# EAGLE design board (EAGLE 9.6.2)
CDESIGNER: Kihun Song; CNAME: nRF52-BLEUart-module; CREVISION: V1.1.0

## Sheet 1 of 2
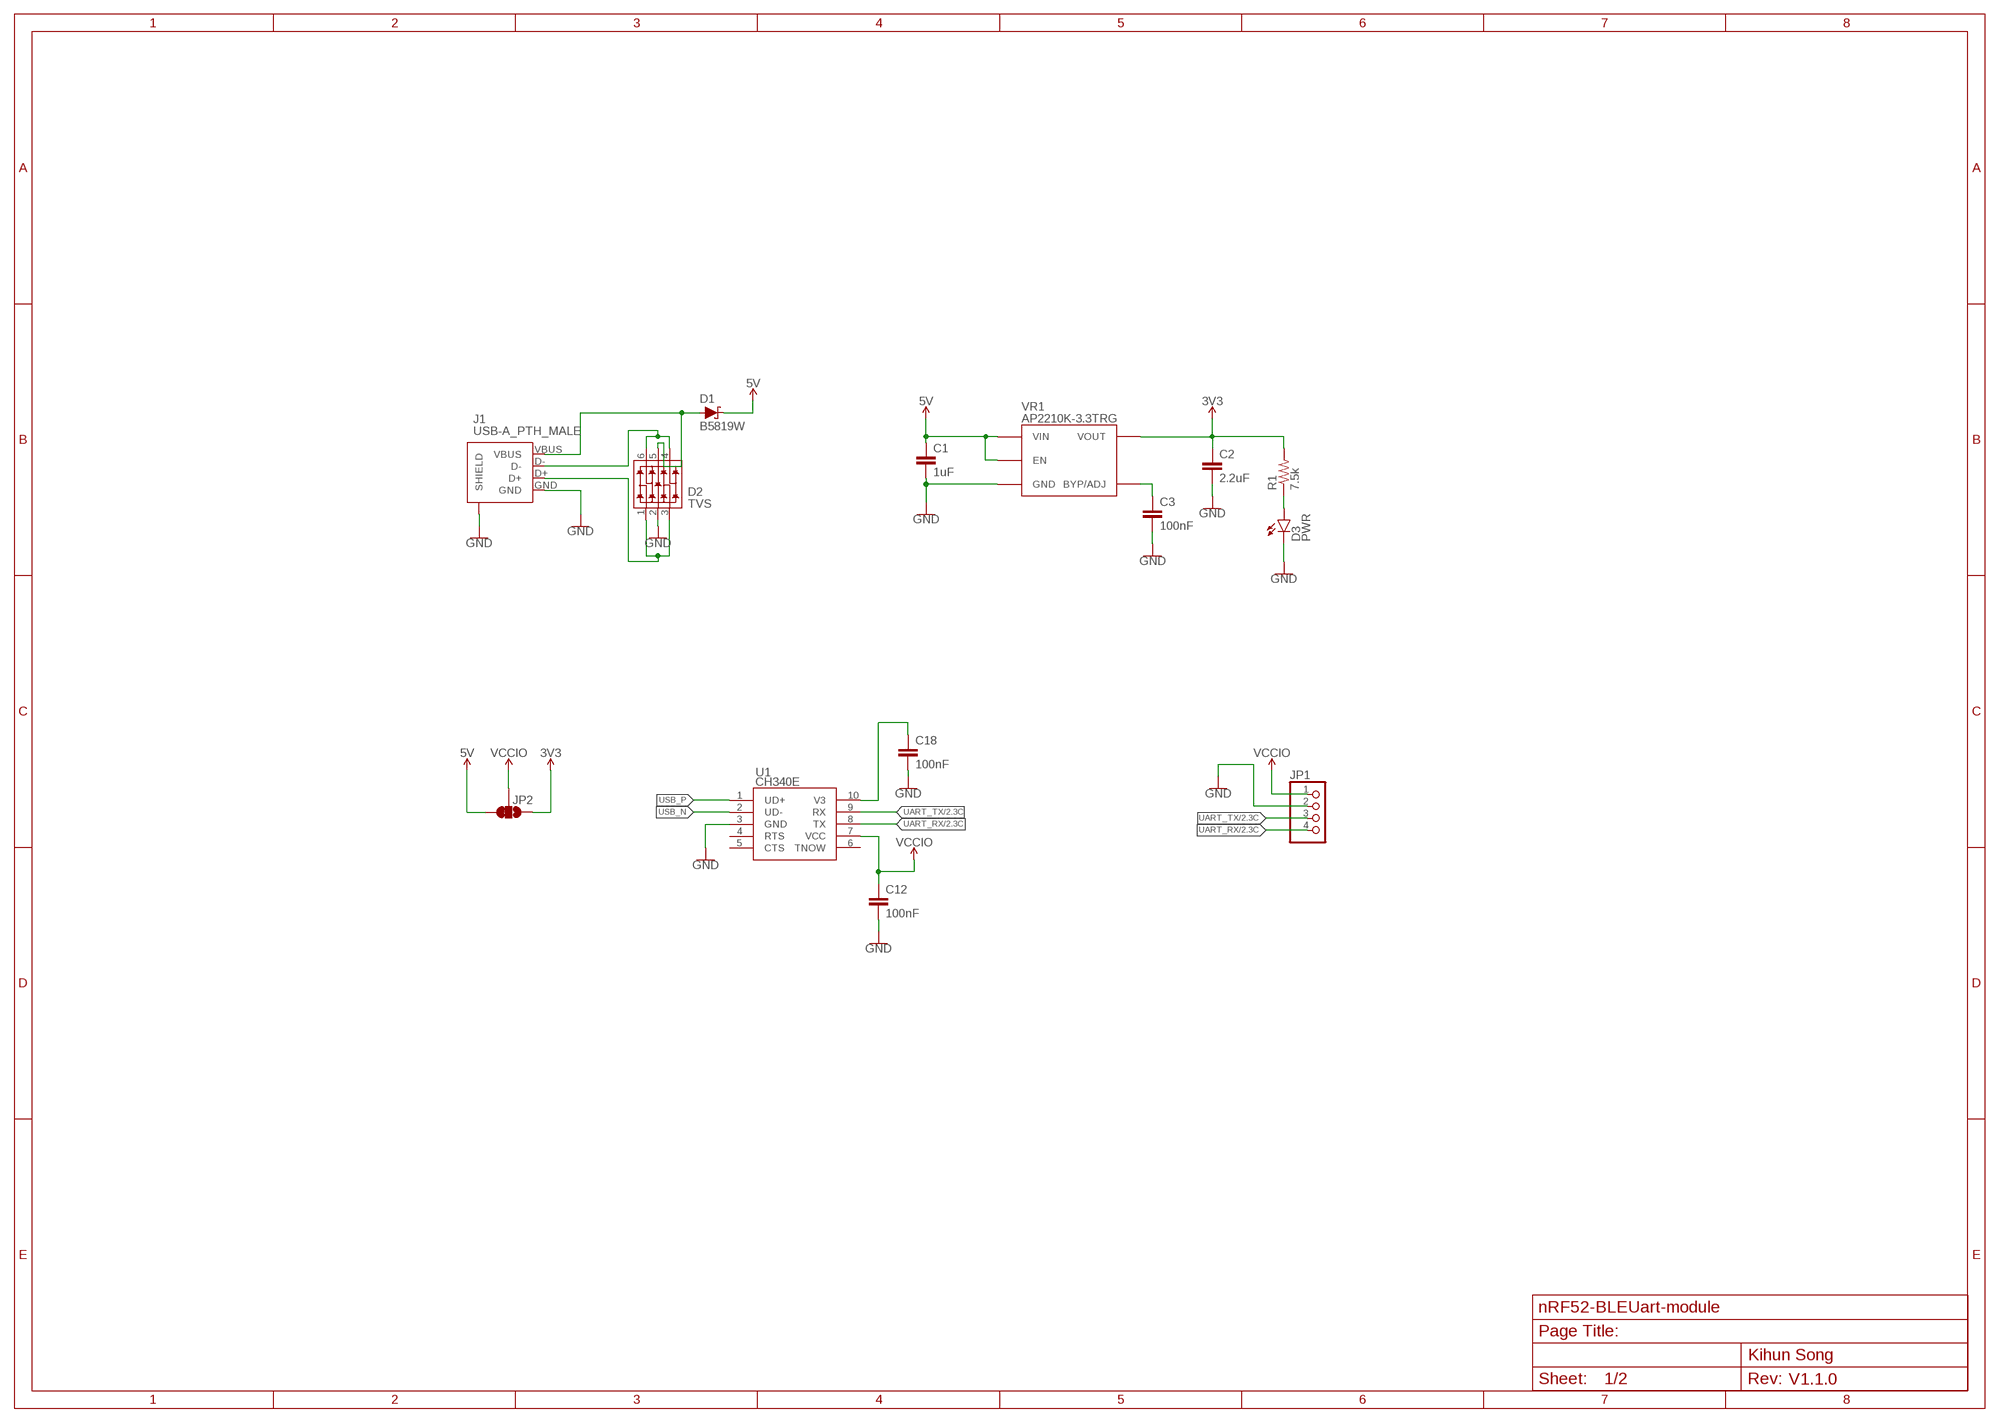
[diagram p0: schematic, sheet 1]

### Parts
C1  1uF  C-NON-POLC0402  [C0402]
C2  2.2uF  C-NON-POLC0603  [C0603]
C3  100nF  C-NON-POLC0402  [C0402]
C12  100nF  C-NON-POLC0402  [C0402]
C18  100nF  C-NON-POLC0402  [C0402]
D1  B5819W  DIODE-SCHOTTKY_SOD-123  [SOD-123]
D2  TVS  TVS-ARRAY_SOT-23-6  [SPT-23-6]
D3  PWR  LED_0603  [LED_0603]
J1  USB-A_PTH_MALE  USB-A_PTH_MALE-U-G-O4DD-W-1  [USB-A-MALE-H-PTH-1]
JP1  Rx Tx G V  PINHD-1X4NOSILK  [1X04-NOSILK]
JP2  5V 3V3  JUMPER-SMT_3_1-NC_TRACE_NO-SILK  [SMT-JUMPER_3_1-NC_TRACE_NO-SILK]
R1  7.5k  RR0402  [R0402]
U1  CH340E  [MSOP-10]
VR1  AP2210K-3.3TRG  AP2210K  [SOT-23-5]

### Nets
3V3 [power]: C2.1 JP2.1 R1.2 VR1.5(VOUT) ; also sheet 2
5V: C1.1 D1.C JP2.3 VR1.1(VIN) VR1.3(EN)
GND [power]: C1.2 C2.2 C3.2 C12.2 C18.2 D2.2(VSS) D3.C J1.GND J1.SHIELD@0(SHIELD) J1.SHIELD@1(SHIELD) J1.SHIELD@2(SHIELD) J1.SHIELD@3(SHIELD) JP1.2 U1.3(GND) VR1.2(GND) ; also sheet 2
N$3 [power]: C3.1 VR1.4(BYP/ADJ)
N$6: D3.A R1.1
N$16 [power]: C18.1 U1.10(V3)
UART_RX: JP1.4 U1.8(TX) ; also sheet 2
UART_TX: JP1.3 U1.9(RX) ; also sheet 2
USB_IN [power]: D1.A D2.5(VCC) J1.VBUS
USB_N: D2.4(IO3) D2.6(IO4) J1.D- U1.2(UD-)
USB_P: D2.1(IO1) D2.3(IO2) J1.D+ U1.1(UD+)
VCCIO [power]: C12.1 JP1.1 JP2.2 U1.7(VCC)
Unconnected: U1.4(RTS) U1.5(CTS) U1.6(TNOW)

## Sheet 2 of 2
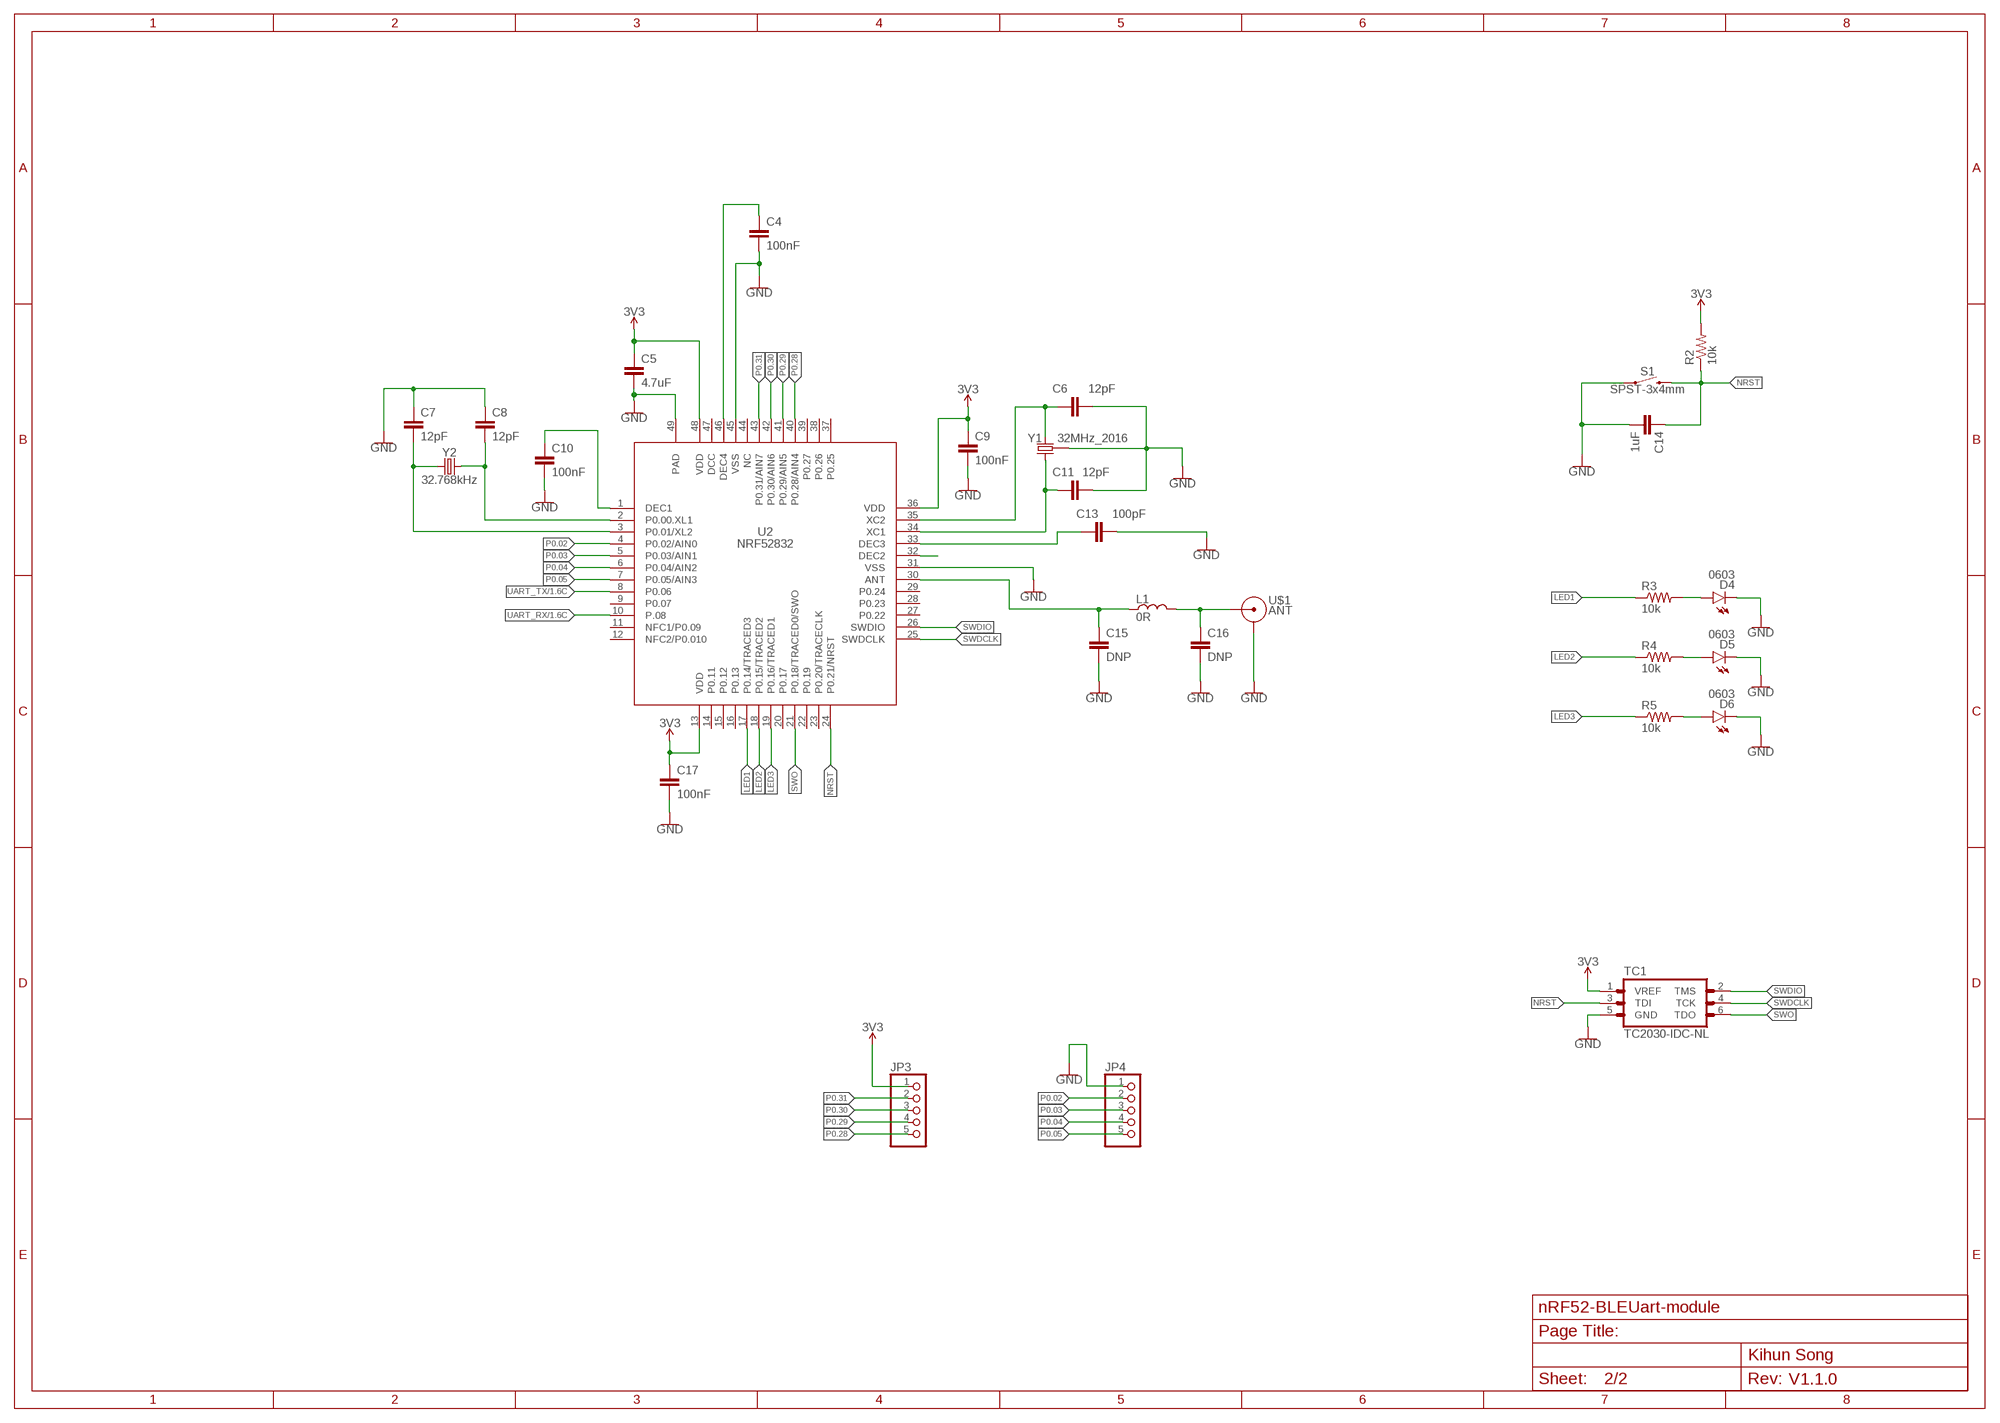
[diagram p1: schematic, sheet 2]

### Parts
C4  100nF  C-NON-POLC0402  [C0402]
C5  4.7uF  C-NON-POLC0402  [C0402]
C6  12pF  C-NON-POLC0402  [C0402]
C7  12pF  C-NON-POLC0402  [C0402]
C8  12pF  C-NON-POLC0402  [C0402]
C9  100nF  C-NON-POLC0402  [C0402]
C10  100nF  C-NON-POLC0402  [C0402]
C11  12pF  C-NON-POLC0402  [C0402]
C13  100pF  C-NON-POLC0402  [C0402]
C14  1uF  C-NON-POLC0402  [C0402]
C15  DNP  C-NON-POLC0402  [C0402]
C16  DNP  C-NON-POLC0402  [C0402]
C17  100nF  C-NON-POLC0402  [C0402]
D4  0603  LED_0603  [LED_0603]
D5  0603  LED_0603  [LED_0603]
D6  0603  LED_0603  [LED_0603]
JP3  PINHD-1X5-NOSILK  [1X05-NOSILK]
JP4  PINHD-1X5-NOSILK  [1X05-NOSILK]
L1  0R  L0402  [R0402]
R2  10k  RR0402  [R0402]
R3  10k  RR0402  [R0402]
R4  10k  RR0402  [R0402]
R5  10k  RR0402  [R0402]
S1  SPST-3x4mm  SWITCH-SPST-SMD-3.0X4.0MM  [TACTILE_SWITCH_SMD_3.0X4.0MM]
TC1  TC2030-IDC-NL  [TC2030-IDC-NL]
U2  NRF52832  [QFN40P600X600X90-49T450N]
U$1  ANT  INVERTED_F_2.4GHZ_TI-AN043_L_SHORT  [TI-AN043_LEFT_SHORTER]
Y1  32MHz_2016  CRYSTAL-2.0X1.6MM  [CRYSTAL-SMD-2.0X1.6MM]
Y2  32.768kHz  CRYSTAL-32.768KHZ_3215  [CRYSTAL-SMD-3.2X1.5MM]

### Nets
3V3 [power]: C5.1 C9.1 C17.1 JP3.1 R2.2 TC1.1(VREF) U2.13(VDD) U2.36(VDD) U2.48(VDD) ; also sheet 1
GND [power]: C4.2 C5.2 C6.2 C7.1 C8.1 C9.2 C10.2 C11.2 C13.2 C14.2 C15.2 C16.2 C17.2 D4.C D5.C D6.C JP4.1 S1.1 TC1.5(GND) U2.31(VSS) U2.45(VSS) U2.49(PAD) U$1.GND Y1.2(GND) Y1.4(GND) ; also sheet 1
LED1: R3.1 U2.17(P0.14/TRACED3)
LED2: R4.1 U2.18(P0.15/TRACED2)
LED3: R5.1 U2.19(P0.16/TRACED1)
N$1: C8.2 U2.2(P0.00.XL1) Y2.P$2
N$2: D4.A R3.2
N$4: C7.2 U2.3(P0.01/XL2) Y2.P$1
N$5 [power]: C10.1 U2.1(DEC1)
N$7 [power]: C4.1 U2.46(DEC4)
N$8: C6.1 U2.35(XC2) Y1.3
N$9: C11.1 U2.34(XC1) Y1.1
N$10 [power]: C13.1 U2.33(DEC3)
N$11: U2.32(DEC2)
N$12: D5.A R4.2
N$14: D6.A R5.2
NRST: C14.1 R2.1 S1.2 TC1.3(TDI) U2.24(P0.21/NRST)
P0.02: JP4.2 U2.4(P0.02/AIN0)
P0.03: JP4.3 U2.5(P0.03/AIN1)
P0.04: JP4.4 U2.6(P0.04/AIN2)
P0.05: JP4.5 U2.7(P0.05/AIN3)
P0.28: JP3.5 U2.40(P0.28/AIN4)
P0.29: JP3.4 U2.41(P0.29/AIN5)
P0.30: JP3.3 U2.42(P0.30/AIN6)
P0.31: JP3.2 U2.43(P0.31/AIN7)
RF-1 [RF]: C15.1 L1.1 U2.30(ANT)
RF-2 [RF]: C16.1 L1.2 U$1.RF(FEED)
SWDCLK: TC1.4(TCK) U2.25(SWDCLK)
SWDIO: TC1.2(TMS) U2.26(SWDIO)
SWO: TC1.6(TDO) U2.21(P0.18/TRACED0/SWO)
UART_RX: U2.10(P.08) ; also sheet 1
UART_TX: U2.8(P0.06) ; also sheet 1
Unconnected: U2.9(P0.07) U2.11(NFC1/P0.09) U2.12(NFC2/P0.010) U2.14(P0.11) U2.15(P0.12) U2.16(P0.13) U2.20(P0.17) U2.22(P0.19) U2.23(P0.20/TRACECLK) U2.27(P0.22) U2.28(P0.23) U2.29(P0.24) U2.37(P0.25) U2.38(P0.26) U2.39(P0.27) U2.44(NC) U2.47(DCC)

## Library data of the parts
C1 C14 = angrypig7-RCL:C-NON-POL; LCSC: C52923; SPICEPREFIX: C
C2 = angrypig7-RCL:C-NON-POL; LCSC: C23630; SPICEPREFIX: C
C3 C4 C9 C10 C12 C17 C18 = angrypig7-RCL:C-NON-POL; LCSC: C1525; SPICEPREFIX: C
C5 = angrypig7-RCL:C-NON-POL; LCSC: C23733; SPICEPREFIX: C
C6-C8 C11 = angrypig7-RCL:C-NON-POL; LCSC: C1547; SPICEPREFIX: C
C13 = angrypig7-RCL:C-NON-POL; LCSC: C1546; SPICEPREFIX: C
C15 C16 = angrypig7-RCL:C-NON-POL; SPICEPREFIX: C
D1 = angrypig7-Diodes:DIODE-SCHOTTKY; LCSC: C8598
D2 = angrypig7-Diodes:TVS-ARRAY; LCSC: C85364
D3 = angrypig7-Diodes:LED; LCSC: C72038
D4-D6 = angrypig7-Diodes:LED; LCSC: C2286
J1 = angrypig7-Connectors-USB:USB-A; LCSC: C9739
JP1 = angrypig7-Connectors-PinHeads:PINHD-1X4: PIN HEADER
JP2 = angrypig7-Jumpers:JUMPER-SMT_3_1-NC_TRACE: Normally closed trace jumper (1 of 2 connections) This jumper has a trace between two pads so it's normally closed (NC). The other connection is normally open (NO). Use a razor knife to open the connection. For best results follow the IPC guidelines for cutting traces: Cutout at least 0.063 mm (0.005 in). Remove all loose material to clean up the cut area. Seal the cut with an approved epoxy. Reapply solder to reclose the connection, or to close the NO connection.
JP3 JP4 = angrypig7-Connectors-PinHeads:PINHD-1X5: PIN HEADER
L1 = angrypig7-RCL:L; LCSC: C17168
R1 = angrypig7-RCL:R; LCSC: C25918; SPICEPREFIX: R
R2-R5 = angrypig7-RCL:R; LCSC: C25744; SPICEPREFIX: R
S1 = angrypig7-Switches:SWITCH-SPST; LCSC: C720477
TC1 = angrypig7-Connectors-Programming:TC2030-IDC: Tag-Connect In Circuit Programming & Debug Cable 6 Pin Link <https://www.tag-connect.com/product/tc2030-idc-10-6-pin-tag-connect-plug-of-nails-spring-pin-cable-with-ribbon-connector-10-version>
U1 = angrypig7-IC:CH340E; LCSC: C99652
U2 = angrypig7-IC-MCU:NRF52832; JLC_ROTATION: 270; LCSC: C77540
U$1 = angrypig7-Antennas:INVERTED_F_2.4GHZ_TI-AN043: 2.4GHz Inverted F Antenna Based on TI Design Note AN043
VR1 = angrypig7-IC-Power:AP2210K: AP2210K-3.3TRG1, 3.3V 300mA ULDO Regulator; LCSC: C176959
Y1 = angrypig7-Clocks:CRYSTAL-2.0X1.6MM; LCSC: C255896
Y2 = angrypig7-Clocks:CRYSTAL-32.768KHZ; LCSC: C32346

## Net classes
0 default: width 0.203 mm
1 power: width 0.305 mm
2 RF: width 0.406 mm

## Board
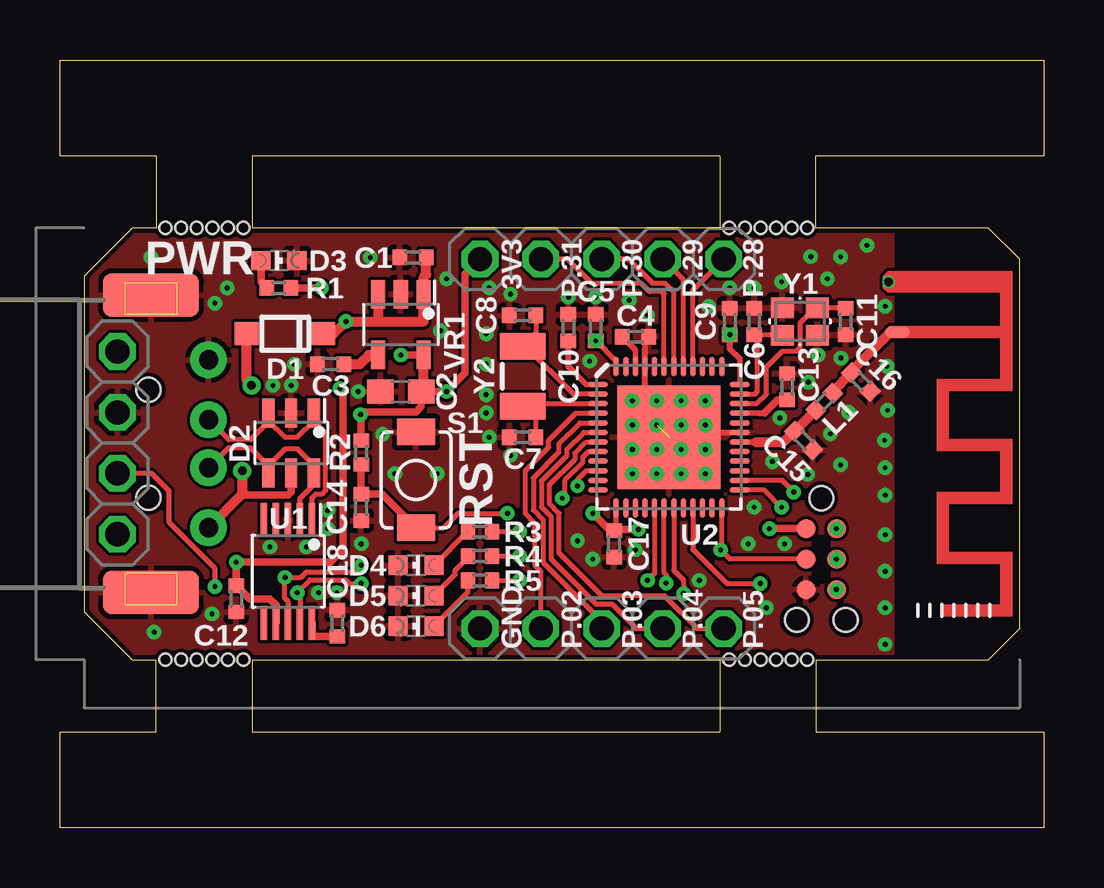
[diagram p2: board, top side]
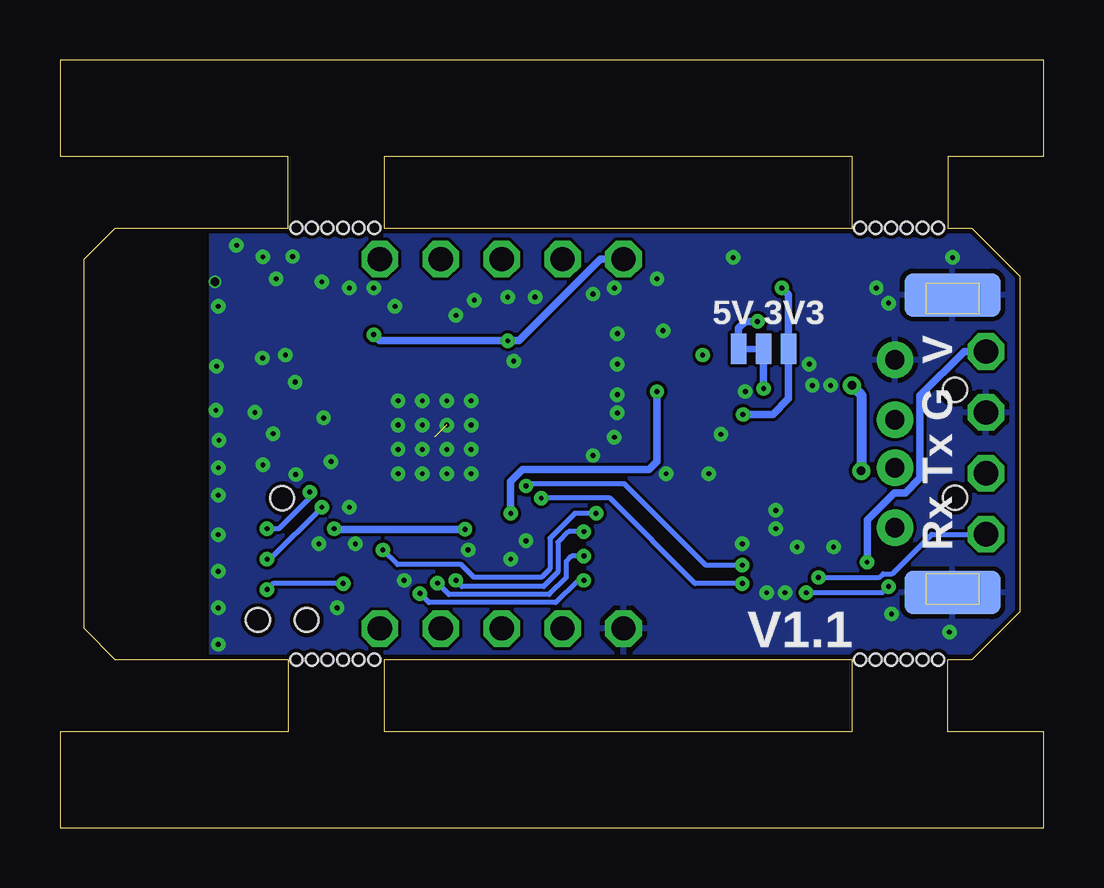
[diagram p3: board, bottom side, seen from below]

Size 41 x 32 mm. Coordinates in mm from the lower left corner, seen from the top.
Outline: 3,7 4,7 4,4 0,4 0,0 41,0 41,4 31.5,4 31.5,7 38.7,7 40,8.3 40,23.7 38.7,25 31.5,25 31.5,28 41,28 41,32 0,32 0,28 4,28 4,25 3,25 1,23 1,9 3,7
Outline: 8,7 27.5,7 27.5,4 8,4 8,7
Outline: 27.5,25 8,25 8,28 27.5,28 27.5,25
Copper layers (1*16): Top 0.035mm / dielectric 1.5mm / Bottom 0.035mm
Design rules "JLCPCB_2-Layer - safe": minimum track width 0.13208125mm, minimum drill 0.2mm, track to track 0.13208125mm, track to pad 0.13208125mm, pad to pad 0.13208125mm, via to via 0.13208125mm, smd to smd 0.13208125mm, copper to edge 8mil, drill to drill 3mil, minimum pad ring 3mil, minimum via ring 0.2mm, stop-mask expansion 4mil, vias tented up to drill 15mil, thermal gap 8mil
Holes 0.5 mm at 4.4,25 5.05,25 5.7,25 6.35,25 7,25 7.65,25 27.9,25 28.55,25 29.2,25 29.85,25 30.5,25 31.15,25 27.9,7 28.55,7 29.2,7 29.85,7 30.5,7 31.15,7 4.4,7 5.05,7 5.7,7 6.35,7 7,7 7.65,7

### Footprints (pad centres in the part's own frame; a part is rotated, then mirrored left to right if it is on the bottom)
C0402 = smd 0.6 x 0.65: 1 -0.551,0; 2 0.551,0
C0603 = smd 1.1 x 1: 1 -0.85,0; 2 0.85,0
SOD-123 = smd 0.988 x 0.95: A 1.6,0; C -1.6,0
SPT-23-6 = smd 1.209 x 0.51: 1 -1.253,0.95; 2 -1.253,0; 3 -1.253,-0.95; 4 1.253,-0.95; 5 1.253,0; 6 1.253,0.95
LED_0603 = smd 0.8 x 0.8: A 0.75,0; C -0.75,0
USB-A-MALE-H-PTH-1 = drill 0.8 pad 1.524: D+ 2.4,1; D- 2.4,-1; GND 2.4,3.5; VBUS 2.4,-3.5 | smd 4 x 1.8: SHIELD@0 0,6.2; SHIELD@1 0,-6.2 | smd 4 x 1.8 bottom: SHIELD@2 0,6.2; SHIELD@3 0,-6.2 | hole 1: -0.1,2.25; -0.1,-2.25
1X04-NOSILK = drill 1.016 pad 1.372 octagon: 1 -3.81,0; 2 -1.27,0; 3 1.27,0; 4 3.81,0
SMT-JUMPER_3_1-NC_TRACE_NO-SILK = smd 0.66 x 1.27: 1 -1.041,0; 2 0,0; 3 1.041,0
1X05-NOSILK = drill 1.016 octagon: 1 -5.08,0; 2 -2.54,0; 3 0,0; 4 2.54,0; 5 5.08,0
R0402 = smd 0.6 x 0.65: 1 -0.5,0; 2 0.5,0
TACTILE_SWITCH_SMD_3.0X4.0MM = smd 1.1 x 1.6: 1 -2,0; 2 2,0
TC2030-IDC-NL = smd 0.787 x 0.787: 1 -1.27,-0.635; 2 -1.27,0.635; 3 0,-0.635; 4 0,0.635; 5 1.27,-0.635; 6 1.27,0.635 | hole 0.991: -2.54,0; 2.54,1.016; 2.54,-1.016
MSOP-10 = smd 1.412 x 0.272: 1 -2.15,1; 2 -2.15,0.5; 3 -2.15,0; 4 -2.15,-0.5; 5 -2.15,-1; 6 2.15,-1; 7 2.15,-0.5; 8 2.15,0; 9 2.15,0.5; 10 2.15,1
QFN40P600X600X90-49T450N = smd 0.811 x 0.22: 1 -2.951,2.2; 2 -2.951,1.8; 3 -2.951,1.4; 4 -2.951,1; 5 -2.951,0.6; 6 -2.951,0.2; 7 -2.951,-0.2; 8 -2.951,-0.6; 9 -2.951,-1; 10 -2.951,-1.4; 11 -2.951,-1.8; 12 -2.951,-2.2; 25 2.951,-2.2; 26 2.951,-1.8; 27 2.951,-1.4; 28 2.951,-1; 29 2.951,-0.6; 30 2.951,-0.2; 31 2.951,0.2; 32 2.951,0.6; 33 2.951,1; 34 2.951,1.4; 35 2.951,1.8; 36 2.951,2.2 | smd 0.22 x 0.811: 13 -2.2,-2.951; 14 -1.8,-2.951; 15 -1.4,-2.951; 16 -1,-2.951; 17 -0.6,-2.951; 18 -0.2,-2.951; 19 0.2,-2.951; 20 0.6,-2.951; 21 1,-2.951; 22 1.4,-2.951; 23 1.8,-2.951; 24 2.2,-2.951; 37 2.2,2.951; 38 1.8,2.951; 39 1.4,2.951; 40 1,2.951; 41 0.6,2.951; 42 0.2,2.951; 43 -0.2,2.951; 44 -0.6,2.951; 45 -1,2.951; 46 -1.4,2.951; 47 -1.8,2.951; 48 -2.2,2.951 | smd 4.3 x 4.3: 49 0,0
TI-AN043_LEFT_SHORTER = drill 0.35: GND 0.45,0.25 | smd 0.483 x 1.016: RF 2.55,0.61
SOT-23-5 = smd 1.189 x 0.589: 1 -1.264,0.95; 2 -1.264,0; 3 -1.264,-0.95; 4 1.264,-0.95; 5 1.264,0.95
CRYSTAL-SMD-2.0X1.6MM = smd 0.95 x 0.85: 1 -0.725,-0.575; 2 0.725,-0.575; 3 0.725,0.575; 4 -0.725,0.575
CRYSTAL-SMD-3.2X1.5MM = smd 1.1 x 1.9: P$1 -1.25,0; P$2 1.25,0

### Placement (x,y rotation side)
C1  14.72,23.76 180 top
C2  14.21,18.18 180 top
C3  11.29,19.32 180 top
C4  23.99,20.46 0 top
C5  22.34,20.84 90 top
C6  28.94,21.1 90 top
C7  19.29,16.27 0 top
C8  19.29,21.35 0 top
C9  27.92,21.1 90 top
C10  21.19,20.84 90 top
C11  32.75,21.1 270 top
C12  7.35,9.54 270 top
C13  30.31,18.38 90 top
C14  12.56,13.35 270 top
C15  31,16.14 315 top
C16  33.38,18.58 315 top
C17  23.1,11.83 270 top
C18  11.56,8.52 90 top
D1  9.38,20.59 180 top
D2  9.64,16.03 270 top
D3  9.13,23.64 180 top
D4  14.84,10.94 0 top
D5  14.84,9.67 0 top
D6  14.84,8.4 0 top
J1  3.79,16 0 top
JP1  2.4,16.03 270 top
JP2  11.67,19.95 180 bottom
JP3  22.59,23.7 0 top
JP4  22.59,8.3 0 top
L1  31.86,17.76 45 top
R1  9.13,22.49 0 top
R2  12.56,15.64 90 top
R3  17.51,12.33 180 top
R4  17.51,11.32 180 top
R5  17.51,10.3 180 top
S1  14.84,14.49 270 top
TC1  31.73,11.19 270 top
U1  9.51,10.68 270 top
U2  25.38,16.27 0 top
U$1  34.3,23.2 270 top
VR1  14.21,20.97 270 top
Y1  30.84,21.1 180 top
Y2  19.29,18.81 90 top

### Tracks (layer width: path | path; a pad name or v marks a point on that pad's centre or on a via)
3V3  (via drill 0.2)
  Top 0.229: U2.36 28.34,19.54 | U2.48 23.18,19.44 C5.1 | U2.13 23.18,12.46
  Top 0.254: C9.1 27.92,19.95 28.34,19.54
  Top 0.305: v14.21,19.7 VR1.5 | R2.2 12.56,17.19 v12.53,17.22 12.64,17.33 14.84,17.33 15.06,17.54 C2.1 | TC1.1 v29.57,12.46 | JP3.1 16.88,23.07 16.88,18.94 v16.11,18.18 15.26,18.18 15.16,18.28 | v10.91,22.49 R1.2 | v24.11,12.43 23.15,12.43 C17.1 | 23.18,12.46 C17.1 | C17.1 22.93,12.38 v22.21,13.1
  Top 0.406: C2.1 15.16,18.28 VR1.5
  Bottom 0.305: v29.57,12.46 29.55,12.43 v24.11,12.43 | JP3.1 18.46,23.7 21.87,20.29 C5.1 27.67,20.29 C9.1 | v16.11,18.18 16.11,15.26 16.44,14.93 21.71,14.93 22.21,14.43 v22.21,13.1 | v10.91,22.49 10.63,22.21 JP2.1 10.63,17.88 11.29,17.22 v12.53,17.22
  other vias: 22.34,20.29 27.92,20.55
5V  (via drill 0.2)
  Top 0.406: VR1.3 13.26,21.1 | D1.C 11.41,20.59 v11.92,21.1 13.26,21.1 | 13.26,21.1 15.16,21.1 VR1.1 15.16,22.94 15.27,23.05 C1.1
  Bottom 0.305: JP2.3 12.71,20.82 12.43,21.1 v11.92,21.1
GND  (via drill 0.2)  (1 unrouted)
  Top 0.229: 24.38,20.31 U2.45 24.38,18.29 | U2.31 27.22,16.47
  Top 0.305: 24.38,20.31 C4.2
  Top 0.406: 27.22,16.47 v26.91,16.78 | 24.38,18.29 v24.88,17.8
  other vias: 12.56,11.83 11.16,12.46 11.16,13.22 8.75,11.7 10.27,11.7 10.78,9.79 3.92,8.14 9.64,18.43 8.87,18.43 15.86,20.72 16.11,22.88 12.94,23.76 9.76,19.32 13.45,16.4 13.95,14.75 15.73,14.75 6.97,22.49 11.54,9.79 21.19,22.11 22.34,22.11 24.5,21.35 34.4,7.63 34.4,9.16 34.4,10.68 34.4,12.21 34.4,13.86 34.37,16.14 34.47,19.23 34.4,21.73 32.54,23.79 25.89,17.8 23.86,17.8 26.91,17.8 25.89,14.75 24.88,14.75 23.86,14.75 26.91,14.75 25.89,15.76 24.88,15.76 23.86,15.76 26.91,15.76 25.89,16.78 24.88,16.78 23.86,16.78 32.56,19.57 27.92,22.49 27.04,21.73 28.94,22.49 30.08,22.75 31.99,22.88 29.45,9.16 26.65,10.3 17.89,16.27 18.78,15.51 18.78,22.24 17.76,20.59 17.76,19.32 17.76,18.05 17.76,17.29 31.61,19.7 31.2,18.57 29.7,15.26 23.73,21.99 28.94,13.35 30.21,11.83 28.69,11.83 33.64,24.27 3.79,23.76 6.46,21.86 32.11,16.42 30.01,17.08 32.88,17.31 31.17,14.72 32.54,15.12 22.08,19.45 17.89,22.49 22.21,11.19 23.99,11.57 21.57,11.95 12.43,18.18 31.3,23.8 34.5,17.4 34.4,15 6.33,8.9
  pour Top (rank 6): 1,25 40,25 40,7 1,7
  pour Bottom (rank 6): 1,25 40,25 40,7 1,7
GND-CUTOUT
  cutout Top: 40,25 34.8,25 34.8,7 40,7
GND-CUTOUT2
  cutout Bottom: 40,25 34.8,25 34.8,7 40,7
LED1  (via drill 0.2)
  Top 0.203: R3.1 v19.16,12.33 | U2.17 24.78,10.59 v24.5,10.3
  Bottom 0.203: v19.16,12.33 19.8,12.33 20.24,11.89 20.24,10.65 20.84,10.05 24.24,10.05 v24.5,10.3
LED2  (via drill 0.2)
  Top 0.203: R4.1 v19.16,11.32 | U2.18 25.18,10.62 25.28,10.52 25.28,10.21 v25.27,10.19
  Bottom 0.203: v19.16,11.32 19.67,11.32 19.91,11.08 19.91,10.41 20.61,9.71 24.79,9.71 v25.27,10.19
LED3  (via drill 0.2)
  Top 0.203: R5.1 v19.16,10.3 | U2.19 25.58,10.73 25.99,10.32 v25.99,9.75
  Bottom 0.203: v25.99,9.75 25.61,9.38 20.34,9.38 19.41,10.3 v19.16,10.3
N$1
  Top 0.203: U2.2 21.41,18.07 19.41,20.06 Y2.P$2 19.84,20.61 C8.2
N$2
  Top 0.203: D4.A 16.99,12.33 R3.2
N$3
  Top 0.406: C3.1 12.49,19.32 12.88,19.71 VR1.4
N$4
  Top 0.203: U2.3 19.4,17.67 Y2.P$1 19.84,17.01 C7.2
N$5
  Top 0.229: U2.1 21.93,18.47
  Top 0.254: C10.1 21.19,19.21 21.93,18.47
N$6
  Top 0.305: R1.1 8.38,22.74 D3.A
N$7
  Top 0.229: U2.46 23.98,19.91
  Top 0.254: 23.98,19.91 C4.1
N$8
  Top 0.203: U2.35 28.96,18.07 29.07,18.18 29.07,20.42 C6.1 30.1,20.55 Y1.3
N$9
  Top 0.203: C11.1 32.83,21.67 Y1.1 31.49,21.67 30.86,21.04 30.86,20.03 30.69,19.86 30.12,19.86 29.45,19.19 29.45,18.08 29.04,17.67 U2.34
N$10
  Top 0.229: U2.33 29.17,17.27
  Top 0.254: 29.17,17.27 29.36,17.27
  Top 0.305: 29.36,17.27 29.91,17.82 C13.1
N$12
  Top 0.203: D5.A 16.48,10.55 16.48,10.72 17.01,11.26 R4.2
N$14
  Top 0.203: D6.A 17.01,9.81 R5.2
N$16
  Top 0.305: C18.1 10.51,7.97 U1.10
NRST  (via drill 0.2)
  Top 0.203: S1.2 15.99,12.49 16.59,13.1 v18.65,13.1 | U2.24 27.58,11.61 v27.54,11.57 27.92,11.19 TC1.3
  Top 0.305: S1.2 13.44,13.9 C14.1 R2.1
  Bottom 0.203: v18.65,13.1 19.54,13.1 20.58,12.05 20.58,10.79 20.94,10.43 23.74,10.43 24.27,10.96 26.93,10.96 v27.54,11.57
P0.02
  Top 0.203: JP4.2 20.05,10.67 19.81,10.91 19.81,12.69 19.4,13.09 19.4,14.88 20.37,15.85 20.37,16.14 21.51,17.27 U2.4
P0.03
  Top 0.203: JP4.3 22.59,8.6 20.14,11.05 20.14,12.82 19.73,13.23 19.73,14.58 20.79,15.63 20.79,15.99 21.67,16.87 U2.5
P0.04
  Top 0.203: JP4.4 24.02,8.3 23,9.32 22.34,9.32 20.48,11.19 20.48,12.96 20.07,13.37 20.07,14.44 21.12,15.49 21.12,15.76 21.84,16.47 U2.6
P0.05
  Top 0.203: JP4.5 26.57,8.3 25.21,9.66 22.6,9.66 20.81,11.45 20.81,13.1 20.41,13.51 20.41,14.3 21.46,15.35 21.46,15.6 21.93,16.07 U2.7
P0.28
  Top 0.203: JP3.5 26.38,22.41 U2.40
P0.29
  Top 0.203: JP3.4 25.98,22.85 U2.41
P0.30
  Top 0.203: JP3.3 23.7,23.7 24.72,22.68 25.22,22.68 25.58,22.31 U2.42
P0.31
  Top 0.203: U2.43 25.18,22.24 25.08,22.34 24.58,22.34 24.24,22.68 22.18,22.68 21.16,23.7 JP3.2
RF-1
  Top 0.229: U2.30 29.01,16.07
  Top 0.406: L1.1 30.63,16.52 C15.1 30.16,16.07 29.01,16.07
RF-2
  Top 0.406: L1.2 32.22,18.18 C16.1 33,19.04 34.61,20.65 U$1.RF
SWDCLK  (via drill 0.2)
  Top 0.203: v30.08,13.35 29.36,14.07 U2.25
  Bottom 0.203: TC1.4 32.24,11.19 v30.08,13.35
  other vias: 32.37,11.19
SWDIO  (via drill 0.2)
  Top 0.203: v30.59,13.98 30.11,14.47 U2.26
  Bottom 0.203: v30.59,13.98 30.59,13.74 31.87,12.46 TC1.2
  other vias: 32.37,12.46
SWO  (via drill 0.2)
  Top 0.203: U2.21 26.38,11.59 27.8,10.18 v29.19,10.18
  Bottom 0.203: v29.19,10.18 32.11,10.18 TC1.6
  other vias: 32.37,9.92
UART_RX  (via drill 0.2)
  Top 0.203: v12.56,10.94 12.28,10.66 10.29,10.66 10.05,10.43 v9.38,10.43 9.36,10.4 9.36,9.57 9.51,9.42 U1.8 | U2.10 21.93,14.87 21.57,14.52 v21.57,14.24
  Bottom 0.203: v12.56,10.94 14.08,10.94 17.48,14.34 21.47,14.34 v21.57,14.24 | JP1.4 4.67,12.22 6.31,10.58 6.68,10.58 6.83,10.43 v9.38,10.43
UART_TX  (via drill 0.2)
  Top 0.203: v12.56,10.18 12.05,10.18 11.9,10.33 10.42,10.33 v9.89,9.79 10.01,9.68 U1.9 | v20.94,13.73 21.04,13.83 21.04,14.46 21.79,15.21 21.79,15.44 22.03,15.67 U2.8 | v6.46,10.05 6.46,10.81 4.56,12.71 4.56,14.03 3.82,14.76 JP1.3
  Bottom 0.203: v12.56,10.18 14.52,10.18 18.08,13.73 v20.94,13.73 | v6.46,10.05 6.71,9.79 v9.89,9.79
USB_IN  (via drill 0.35)
  Top 0.305: D2.5 9.64,13.98 9.51,13.86 7.6,13.86 7.58,13.88
  Top 0.406: v7.99,18.43 7.78,18.63 D1.A | J1.VBUS 7.58,13.88 7.6,13.91 v7.6,14.87
  Bottom 0.406: v7.99,18.43 7.6,18.05 v7.6,14.87
USB_N
  Top 0.203: J1.D- 7.03,15.83 7.95,15.83 8.69,15.1 D2.4 8.69,15.07 9.41,15.79 9.89,15.79 10.59,15.1 D2.6 10.59,14.3 10.01,13.72 U1.2
USB_P
  Top 0.203: J1.D+ 7.03,16.17 7.95,16.17 8.69,16.9 D2.3 8.69,16.97 9.38,16.27 9.89,16.27 10.59,16.97 | 10.59,16.97 D2.1 | U1.1 10.51,13.75 10.67,13.91 10.94,13.91 11.07,14.05 11.07,16.48 10.59,16.97
VCCIO  (via drill 0.2)
  Top 0.305: v11.67,18.3 11.79,18.18 11.79,11.57 11.29,11.06 v7.35,11.06 C12.1 7.9,9.54 8.75,9.54 9.01,9.28 U1.7
  Bottom 0.305: JP2.2 v11.67,18.3 | v7.35,11.06 7.35,12.82 6.22,13.95 5.76,13.95 5.15,14.57 5.15,18.01 3.31,19.84 JP1.1

### Text on the board
tPlace: 3V3 / / P.31 / / P.30 / / P.29 / / P.28 | RST | GND / / P.02 / / P.03 / / P.04 / / P.05